# Altium schematic sheet MCLR.SchDoc
size A; SheetNumber: 3; SheetTotal: 7
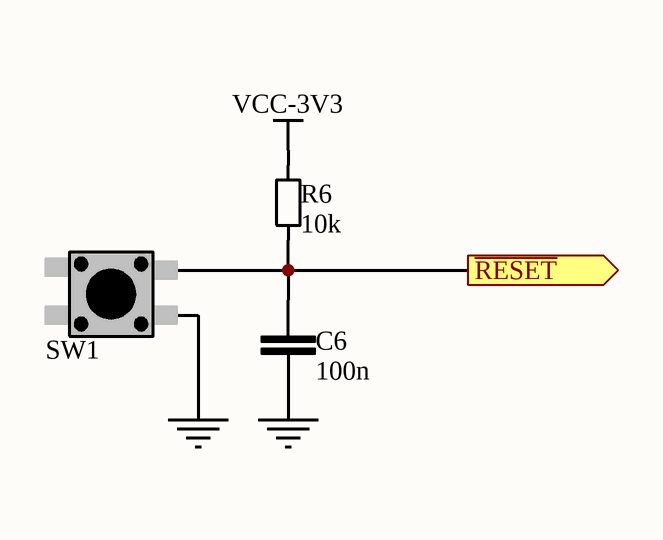
[diagram p0: MCLR.SchDoc]

## Parts
C6  100n  [CER_0603]
R6  10k  [RESC2013X38N-0805-NOOVERLAY]
SW1  TASTER  [TASTER_SMD]  (value not drawn)

## Ports
~{RESET} (out)

## Nets
GND: C6.1 SW1.1
VCC-3V3: R6.2
~{RESET}: C6.2 R6.1 SW1.2 ; port ~{RESET}

## Library data of the parts
C6 = 06032105: CAP CER 100n 10V X5R 10% 0603; Capacitance: 100n
R6 = 000001002: RES SMD 10 kOhm 1/8W 0805; Resistance: 10k